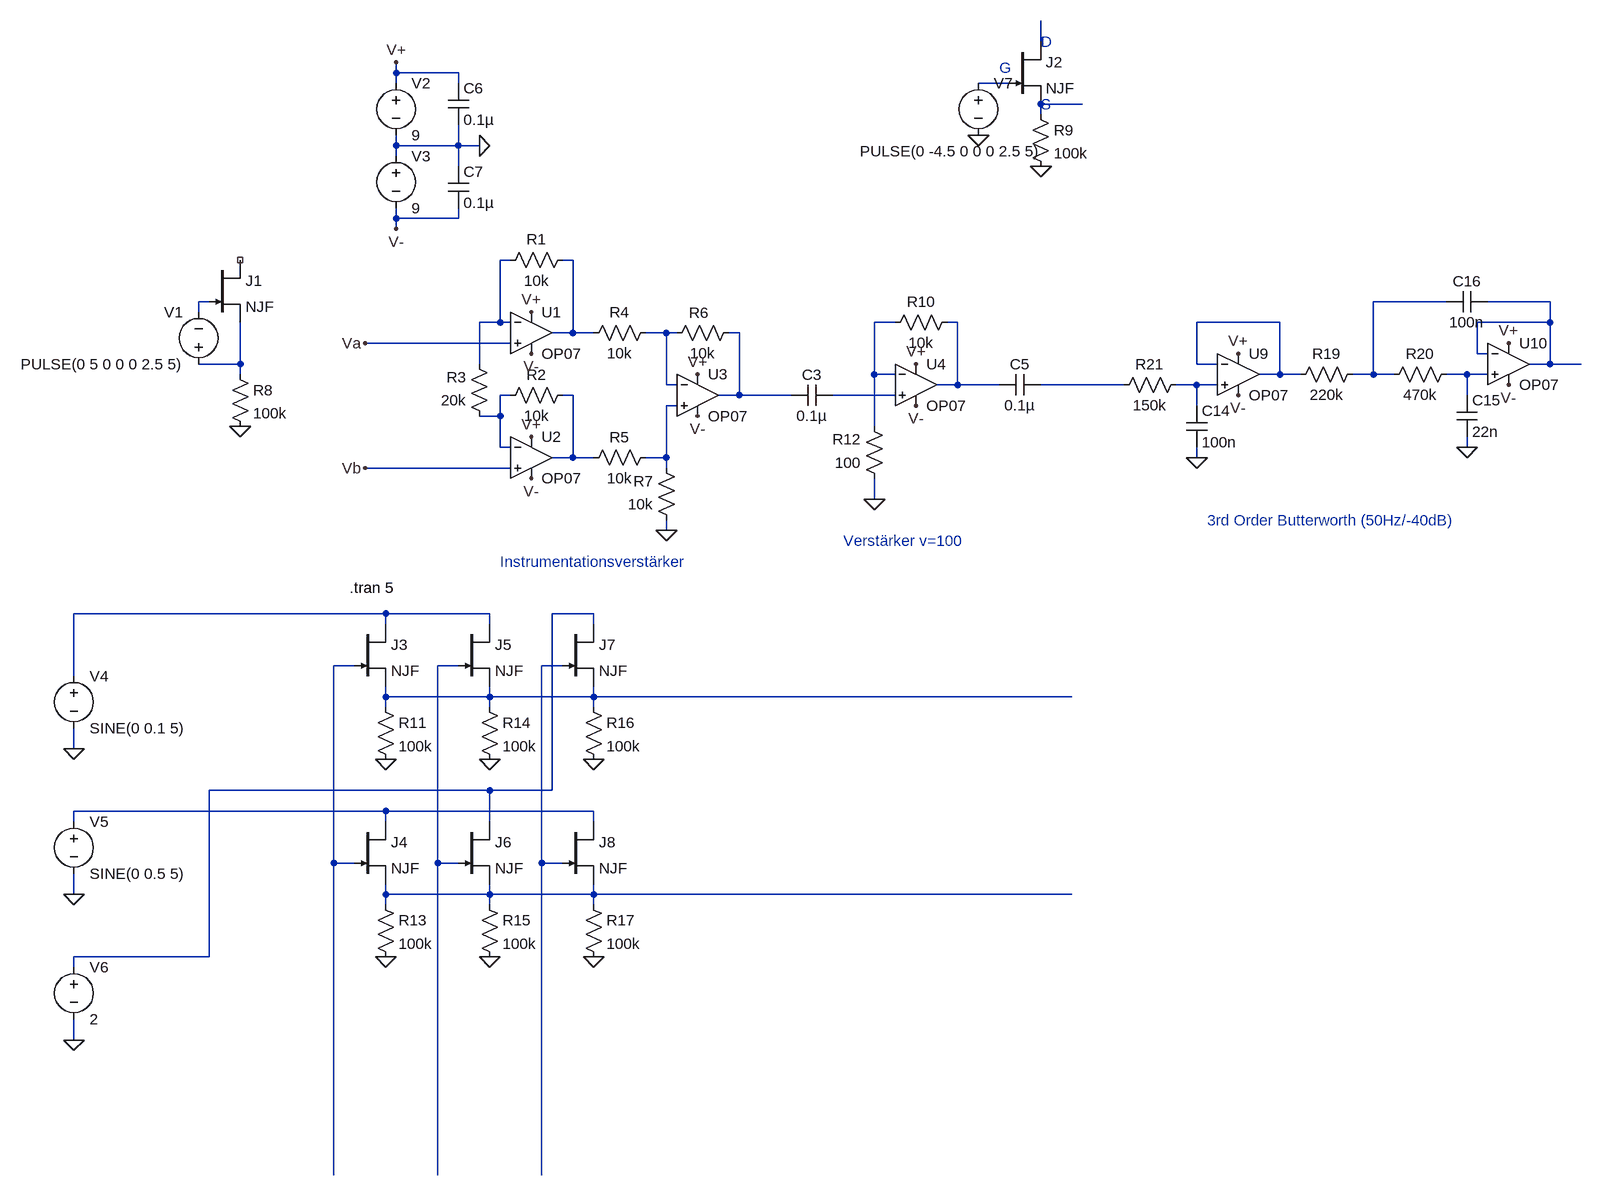
[diagram p0: schematic ekg_v5_full_switch.asc]
ekg_v5_full_switch.asc, the LTspice schematic file:
Version 4
SHEET 1 2260 1444
WIRE 1424 -304 1424 -336
WIRE 432 -256 432 -272
WIRE 528 -256 432 -256
WIRE 432 -240 432 -256
WIRE 528 -240 528 -256
WIRE 1376 -240 1328 -240
WIRE 1488 -208 1424 -208
WIRE 1424 -192 1424 -208
WIRE 432 -144 432 -160
WIRE 528 -144 528 -176
WIRE 528 -144 432 -144
WIRE 560 -144 528 -144
WIRE 432 -128 432 -144
WIRE 528 -112 528 -144
WIRE 432 -32 432 -48
WIRE 528 -32 528 -48
WIRE 528 -32 432 -32
WIRE 432 -16 432 -32
WIRE 608 32 592 32
WIRE 704 32 688 32
WIRE 144 96 128 96
WIRE 2048 96 1936 96
WIRE 2208 96 2112 96
WIRE 128 112 128 96
WIRE 592 128 592 32
WIRE 592 128 560 128
WIRE 608 128 592 128
WIRE 1200 128 1168 128
WIRE 1296 128 1280 128
WIRE 1792 128 1664 128
WIRE 2208 128 2208 96
WIRE 2208 128 2096 128
WIRE 704 144 704 32
WIRE 704 144 672 144
WIRE 736 144 704 144
WIRE 848 144 816 144
WIRE 864 144 848 144
WIRE 960 144 944 144
WIRE 608 160 384 160
WIRE 2096 176 2096 128
WIRE 2112 176 2096 176
WIRE 192 192 192 128
WIRE 192 192 128 192
WIRE 560 192 560 128
WIRE 1664 192 1664 128
WIRE 1696 192 1664 192
WIRE 2208 192 2208 128
WIRE 2208 192 2176 192
WIRE 2256 192 2208 192
WIRE 192 208 192 192
WIRE 1168 208 1168 128
WIRE 1200 208 1168 208
WIRE 1792 208 1792 128
WIRE 1792 208 1760 208
WIRE 1824 208 1792 208
WIRE 1936 208 1936 96
WIRE 1936 208 1904 208
WIRE 1968 208 1936 208
WIRE 2080 208 2048 208
WIRE 2112 208 2080 208
WIRE 848 224 848 144
WIRE 864 224 848 224
WIRE 1296 224 1296 128
WIRE 1296 224 1264 224
WIRE 1360 224 1296 224
WIRE 1552 224 1424 224
WIRE 1664 224 1632 224
WIRE 1696 224 1664 224
WIRE 608 240 592 240
WIRE 704 240 688 240
WIRE 960 240 960 144
WIRE 960 240 928 240
WIRE 1040 240 960 240
WIRE 1200 240 1104 240
WIRE 2080 240 2080 208
WIRE 864 256 848 256
WIRE 1664 256 1664 224
WIRE 592 272 592 240
WIRE 592 272 560 272
WIRE 1168 288 1168 208
WIRE 592 320 592 272
WIRE 608 320 592 320
WIRE 2080 320 2080 304
WIRE 704 336 704 240
WIRE 704 336 672 336
WIRE 736 336 704 336
WIRE 848 336 848 256
WIRE 848 336 816 336
WIRE 1664 336 1664 320
WIRE 608 352 384 352
WIRE 848 352 848 336
WIRE 1168 400 1168 368
WIRE 848 448 848 432
WIRE 416 576 -64 576
WIRE 576 576 416 576
WIRE 736 576 672 576
WIRE 416 592 416 576
WIRE 576 592 576 576
WIRE 736 592 736 576
WIRE 368 656 336 656
WIRE 528 656 496 656
WIRE 688 656 656 656
WIRE -64 672 -64 576
WIRE 416 704 416 688
WIRE 576 704 576 688
WIRE 576 704 416 704
WIRE 736 704 736 688
WIRE 736 704 576 704
WIRE 1472 704 736 704
WIRE 416 720 416 704
WIRE 576 720 576 704
WIRE 736 720 736 704
WIRE -64 784 -64 752
WIRE 576 848 144 848
WIRE 672 848 672 576
WIRE 672 848 576 848
WIRE 416 880 -64 880
WIRE 736 880 416 880
WIRE -64 896 -64 880
WIRE 416 896 416 880
WIRE 576 896 576 848
WIRE 736 896 736 880
WIRE 336 960 336 656
WIRE 368 960 336 960
WIRE 496 960 496 656
WIRE 528 960 496 960
WIRE 656 960 656 656
WIRE 688 960 656 960
WIRE -64 1008 -64 976
WIRE 416 1008 416 992
WIRE 576 1008 576 992
WIRE 576 1008 416 1008
WIRE 736 1008 736 992
WIRE 736 1008 576 1008
WIRE 1472 1008 736 1008
WIRE 416 1024 416 1008
WIRE 576 1024 576 1008
WIRE 736 1024 736 1008
WIRE 144 1104 144 848
WIRE 144 1104 -64 1104
WIRE -64 1120 -64 1104
WIRE -64 1232 -64 1200
WIRE 336 1440 336 960
WIRE 496 1440 496 960
WIRE 656 1440 656 960
FLAG 848 448 0
FLAG 432 -272 V+
FLAG 640 176 V-
FLAG 640 368 V-
FLAG 896 272 V-
FLAG 560 -144 0
FLAG 432 -16 V-
FLAG 640 112 V+
FLAG 896 208 V+
FLAG 640 304 V+
FLAG 1168 400 0
FLAG 1232 192 V+
FLAG 1232 256 V-
FLAG 384 160 Va
FLAG 384 352 Vb
FLAG 1664 336 0
FLAG 2080 320 0
FLAG 1728 176 V+
FLAG 2144 160 V+
FLAG 1728 240 V-
FLAG 2144 224 V-
FLAG -64 784 0
FLAG -64 1008 0
FLAG -64 1232 0
FLAG 1328 -160 0
FLAG 1424 -112 0
FLAG 192 288 0
FLAG 416 800 0
FLAG 416 1104 0
FLAG 576 1104 0
FLAG 576 800 0
FLAG 736 800 0
FLAG 736 1104 0
SYMBOL OpAmps\\OP07 640 80 R0
SYMATTR InstName U1
SYMBOL OpAmps\\OP07 640 272 R0
SYMATTR InstName U2
SYMBOL OpAmps\\OP07 896 176 R0
SYMATTR InstName U3
SYMBOL res 704 224 R90
WINDOW 0 0 56 VBottom 2
WINDOW 3 32 56 VTop 2
SYMATTR InstName R2
SYMATTR Value 10k
SYMBOL res 704 16 R90
WINDOW 0 0 56 VBottom 2
WINDOW 3 32 56 VTop 2
SYMATTR InstName R1
SYMATTR Value 10k
SYMBOL res 576 288 R180
WINDOW 0 36 76 Left 2
WINDOW 3 36 40 Left 2
SYMATTR InstName R3
SYMATTR Value 20k
SYMBOL res 832 128 R90
WINDOW 0 0 56 VBottom 2
WINDOW 3 32 56 VTop 2
SYMATTR InstName R4
SYMATTR Value 10k
SYMBOL res 832 320 R90
WINDOW 0 0 56 VBottom 2
WINDOW 3 32 56 VTop 2
SYMATTR InstName R5
SYMATTR Value 10k
SYMBOL res 960 128 R90
WINDOW 0 1 62 VBottom 2
WINDOW 3 32 56 VTop 2
SYMATTR InstName R6
SYMATTR Value 10k
SYMBOL res 864 448 R180
WINDOW 0 36 76 Left 2
WINDOW 3 36 40 Left 2
SYMATTR InstName R7
SYMATTR Value 10k
SYMBOL voltage 432 -256 R0
WINDOW 123 0 0 Left 0
WINDOW 39 0 0 Left 0
SYMATTR InstName V2
SYMATTR Value 9
SYMBOL voltage 432 -144 R0
SYMATTR InstName V3
SYMATTR Value 9
SYMBOL OpAmps\\OP07 1232 160 R0
SYMATTR InstName U4
SYMBOL res 1296 112 R90
WINDOW 0 0 56 VBottom 2
WINDOW 3 32 56 VTop 2
SYMATTR InstName R10
SYMATTR Value 10k
SYMBOL res 1184 384 R180
WINDOW 0 36 76 Left 2
WINDOW 3 36 40 Left 2
SYMATTR InstName R12
SYMATTR Value 100
SYMBOL cap 1104 224 R90
WINDOW 0 0 32 VBottom 2
WINDOW 3 32 32 VTop 2
SYMATTR InstName C3
SYMATTR Value 0.1µ
SYMBOL cap 1424 208 R90
WINDOW 0 0 32 VBottom 2
WINDOW 3 32 32 VTop 2
SYMATTR InstName C5
SYMATTR Value 0.1µ
SYMBOL cap 512 -240 R0
SYMATTR InstName C6
SYMATTR Value 0.1µ
SYMBOL cap 512 -112 R0
SYMATTR InstName C7
SYMATTR Value 0.1µ
SYMBOL OpAmps\\OP07 1728 144 R0
SYMATTR InstName U9
SYMBOL cap 1648 256 R0
SYMATTR InstName C14
SYMATTR Value 100n
SYMBOL res 1920 192 R90
WINDOW 0 0 56 VBottom 2
WINDOW 3 32 56 VTop 2
SYMATTR InstName R19
SYMATTR Value 220k
SYMBOL res 2064 192 R90
WINDOW 0 0 56 VBottom 2
WINDOW 3 32 56 VTop 2
SYMATTR InstName R20
SYMATTR Value 470k
SYMBOL cap 2064 240 R0
SYMATTR InstName C15
SYMATTR Value 22n
SYMBOL OpAmps\\OP07 2144 128 R0
SYMATTR InstName U10
SYMBOL cap 2112 80 R90
WINDOW 0 0 32 VBottom 2
WINDOW 3 32 32 VTop 2
SYMATTR InstName C16
SYMATTR Value 100n
SYMBOL res 1648 208 R90
WINDOW 0 0 56 VBottom 2
WINDOW 3 32 56 VTop 2
SYMATTR InstName R21
SYMATTR Value 150k
SYMBOL voltage -64 656 R0
WINDOW 123 0 0 Left 0
WINDOW 39 0 0 Left 0
SYMATTR InstName V4
SYMATTR Value SINE(0 0.1 5)
SYMBOL voltage -64 880 R0
WINDOW 123 0 0 Left 0
WINDOW 39 0 0 Left 0
SYMATTR InstName V5
SYMATTR Value SINE(0 0.5 5)
SYMBOL voltage -64 1104 R0
SYMATTR InstName V6
SYMATTR Value 2
SYMBOL njf 1376 -304 R0
SYMATTR InstName J2
SYMBOL voltage 1328 -256 R0
WINDOW 3 -182 121 Left 2
WINDOW 123 0 0 Left 0
WINDOW 39 0 0 Left 0
SYMATTR Value PULSE(0 -4.5 0 0 0 2.5 5)
SYMATTR InstName V7
SYMBOL res 1408 -208 R0
SYMATTR InstName R9
SYMATTR Value 100k
SYMBOL njf 144 32 R0
SYMATTR InstName J1
SYMBOL voltage 128 208 R180
WINDOW 0 24 96 Left 2
WINDOW 3 24 16 Left 2
WINDOW 123 0 0 Left 0
WINDOW 39 0 0 Left 0
SYMATTR InstName V1
SYMATTR Value PULSE(0 5 0 0 0 2.5 5)
SYMBOL res 176 192 R0
SYMATTR InstName R8
SYMATTR Value 100k
SYMBOL njf 368 592 R0
SYMATTR InstName J3
SYMBOL njf 368 896 R0
SYMATTR InstName J4
SYMBOL res 400 704 R0
SYMATTR InstName R11
SYMATTR Value 100k
SYMBOL res 400 1008 R0
SYMATTR InstName R13
SYMATTR Value 100k
SYMBOL njf 528 592 R0
SYMATTR InstName J5
SYMBOL njf 528 896 R0
SYMATTR InstName J6
SYMBOL res 560 704 R0
SYMATTR InstName R14
SYMATTR Value 100k
SYMBOL res 560 1008 R0
SYMATTR InstName R15
SYMATTR Value 100k
SYMBOL njf 688 896 R0
SYMATTR InstName J8
SYMBOL res 720 704 R0
SYMATTR InstName R16
SYMATTR Value 100k
SYMBOL res 720 1008 R0
SYMATTR InstName R17
SYMATTR Value 100k
SYMBOL njf 688 592 R0
SYMATTR InstName J7
TEXT 592 496 Left 2 ;Instrumentationsverstärker
TEXT 360 536 Left 2 !.tran 5
TEXT 1120 464 Left 2 ;Verstärker v=100
TEXT 1680 432 Left 2 ;3rd Order Butterworth (50Hz/-40dB)
TEXT 1424 -304 Left 2 ;D
TEXT 1424 -208 Left 2 ;S
TEXT 1360 -264 Left 2 ;G

The netlist it stands for:
* ekg_v5_full_switch.asc
XU1 Va N004 V+ V- N005 LT1001  ; OP07, pins In+ In- V+ V- OUT
XU2 Vb N018 V+ V- N019 LT1001  ; OP07, pins In+ In- V+ V- OUT
XU3 N021 N012 V+ V- N013 LT1001  ; OP07, pins In+ In- V+ V- OUT
R2 N019 N018 10k
R1 N005 N004 10k
R3 N018 N004 20k
R4 N012 N005 10k
R5 N021 N019 10k
R6 N013 N012 10k
R7 0 N021 10k
V2 V+ 0 9
V3 0 V- 9
XU4 N020 N009 V+ V- N010 LT1001  ; OP07, pins In+ In- V+ V- OUT
R10 N010 N009 10k
R12 0 N009 100
C3 N020 N013 0.1µ
C5 N016 N010 0.1µ
C6 V+ 0 0.1µ
C7 0 V- 0.1µ
XU9 N017 N011 V+ V- N011 LT1001  ; OP07, pins In+ In- V+ V- OUT
C14 N017 0 100n
R19 N007 N011 220k
R20 N015 N007 470k
C15 N015 0 22n
XU10 N015 N008 V+ V- N008 LT1001  ; OP07, pins In+ In- V+ V- OUT
C16 N008 N007 100n
R21 N017 N016 150k
V4 N022 0 SINE(0 0.1 5)
V5 N028 0 SINE(0 0.5 5)
V6 N023 0 2
J2 N001 N002 N003 NJF
V7 N002 0 PULSE(0 -4.5 0 0 0 2.5 5)
R9 N003 0 100k
J1 NC_01 N006 N014 NJF
V1 N014 N006 PULSE(0 5 0 0 0 2.5 5)
R8 N014 0 100k
J3 N022 N024 N027 NJF
J4 N028 N024 N029 NJF
R11 N027 0 100k
R13 N029 0 100k
J5 N022 N025 N027 NJF
J6 N023 N025 N029 NJF
R14 N027 0 100k
R15 N029 0 100k
J8 N028 N026 N029 NJF
R16 N027 0 100k
R17 N029 0 100k
J7 N023 N026 N027 NJF
.model NJF NJF
.model PJF PJF
.lib standard.jft
* Instrumentationsverstärker
.tran 5
* Verstärker v=100
* 3rd Order Butterworth (50Hz/-40dB)
* D
* S
* G
.lib LTC.lib
.backanno
.end